# EAGLE design axxl_v0.1 (EAGLE 6.6.0)
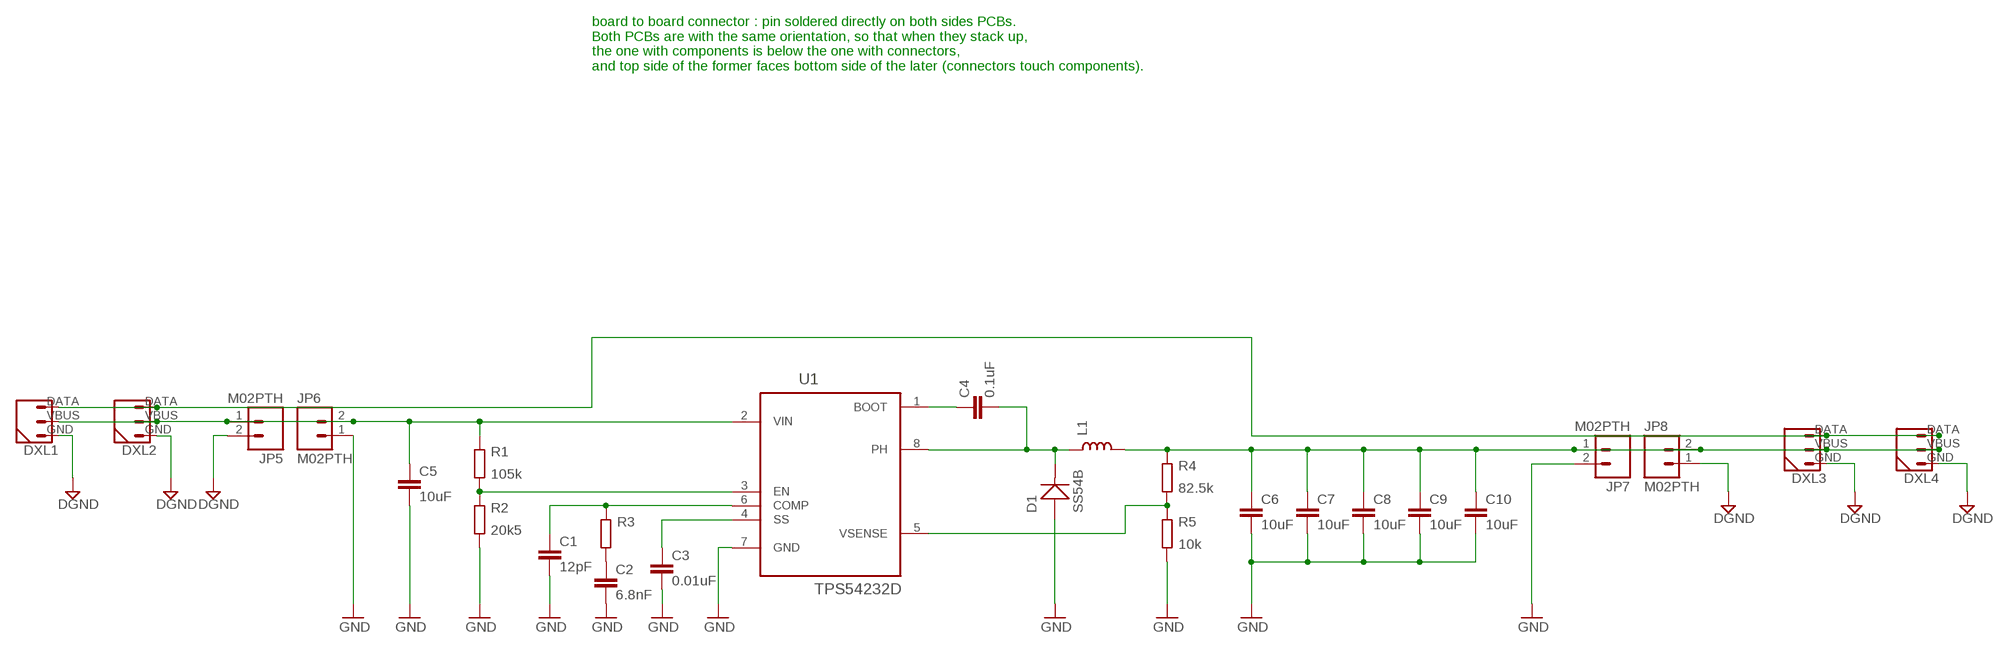
[diagram p0: schematic, sheet 1]

## Parts
C1  12pF  C0402  [0402_N]
C2  6.8nF  C0402  [0402_N]
C3  0.01uF  C0402  [0402_N]
C4  0.1uF  C0402  [0402_N]
C5  10uF  C0805  [0805_N]
C6  10uF  C0805  [0805_N]
C7  10uF  C0805  [0805_N]
C8  10uF  C0805  [0805_N]
C9  10uF  C0805  [0805_N]
C10  10uF  C0805  [0805_N]
D1  SS54B  D-SMB  [SMB]
DXL1  DYNAMIXEL_3POS-R  [DYNAMIXEL_3POS_RIGHT]
DXL2  DYNAMIXEL_3POS-R  [DYNAMIXEL_3POS_RIGHT]
DXL3  DYNAMIXEL_3POS-XL-R  [DYNAMIXEL_XL_RIGHT]
DXL4  DYNAMIXEL_3POS-XL-R  [DYNAMIXEL_XL_RIGHT]
JP5  M02PTH  [1X02]
JP6  M02PTH  [1X02]
JP7  M02PTH  [1X02]
JP8  M02PTH  [1X02]
L1  L-SMD_8X8  [L_SRU8043]
R1  105k  R0402  [0402_N]
R2  20k5  R0402  [0402_N]
R3  R0402  [0402_N]
R4  82.5k  R0402  [0402_N]
R5  10k  R0402  [0402_N]
U1  TPS54232D  [SOIC127P600X175-8N]

## Nets
DGND: DXL1.GND DXL2.GND DXL3.GND DXL4.GND JP5.2 JP8.1
GND: C1.2 C2.2 C3.2 C5.2 C6.2 C7.2 C8.2 C9.2 C10.2 D1.+ JP6.1 JP7.2 R2.1 R5.1 U1.7(GND)
N$2: C1.1 R3.2 U1.6(COMP)
N$3: C6.1 C7.1 C8.1 C9.1 C10.1 DXL3.VBUS DXL4.VBUS JP7.1 JP8.2 L1.P$2 R4.2
N$4: R1.1 R2.2 U1.3(EN)
N$5: C2.1 R3.1
N$6: C3.1 U1.4(SS)
N$7: C4.1 U1.1(BOOT)
N$8: C4.2 D1.- L1.P$1 U1.8(PH)
N$9: DXL1.DATA DXL2.DATA DXL3.DATA DXL4.DATA
N$11: R4.1 R5.2 U1.5(VSENSE)
N$12: C5.1 DXL1.VBUS DXL2.VBUS JP5.1 JP6.2 R1.2 U1.2(VIN)

## Notes on the sheet
- board to board connector : pin soldered directly on both sides PCBs.
  Both PCBs are with the same orientation, so that when they stack up,
  the one with components is below the one with connectors,
  and top side of the former faces bottom side of the later (connectors touch components).

## Library data of the parts
C1-C10 = Xevelabs:C: Non-polarized Capacitor
D1 = OPL:D*: DIODE
DXL1-DXL4 = Xevelabs:DYNAMIXEL_3POS
JP5-JP8 = SparkFun-Connectors:M02: Standard 2-pin 0.1" header. Use with - straight break away headers ( PRT-00116) - right angle break away headers (PRT-00553) - swiss pins (PRT-00743) - machine pins (PRT-00117) - female headers (PRT-00115) Molex polarized connector foot print use with: PRT-08233 with associated crimp pins and housings. 2.54_SCREWTERM for use with PRT-10571. 3.5mm Screw Terminal footprints for PRT-08084 5mm Screw Terminal footprints for use with PRT-08433
L1 = AirQuality-sensors:L
R1-R5 = Xevelabs:R: Resistor
U1 = Xevelabs:TPS54232D: DC/DC CONVERTER; MPN: TPS54232D; OC_FARNELL: 1694430; OC_NEWARK: 45P2940; PACKAGE: SOIC-8; SUPPLIER: TEXAS INSTRUMENTS

## Board
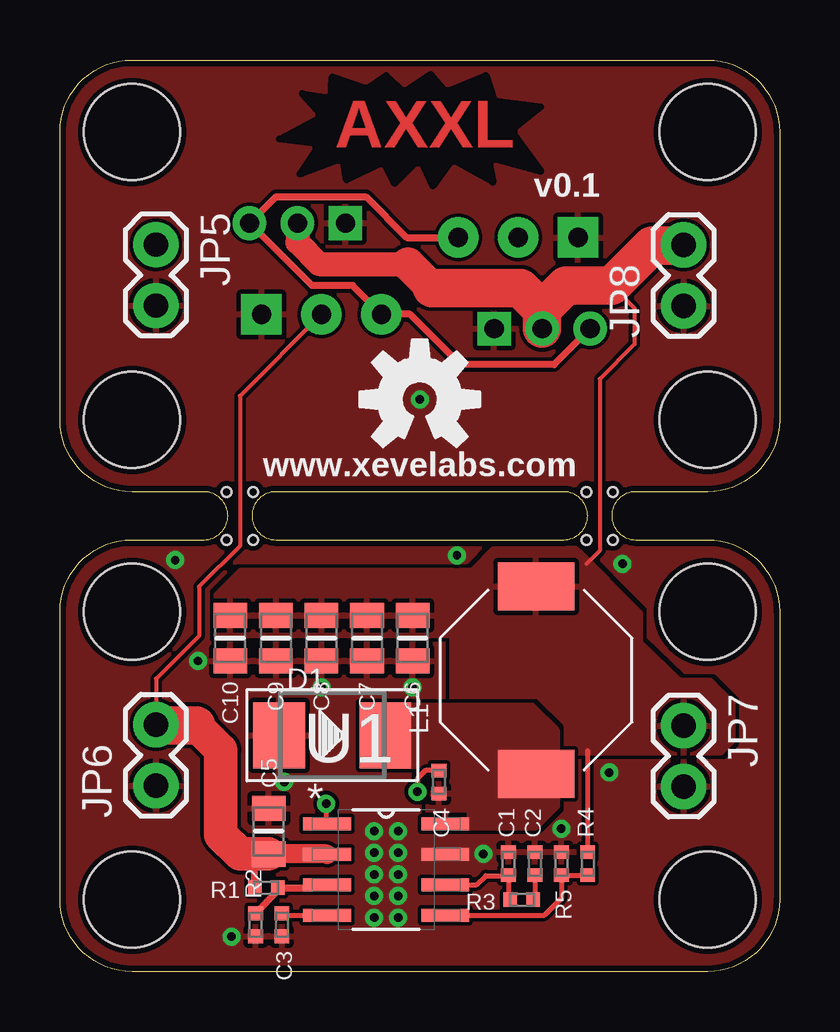
[diagram p1: board, top side]
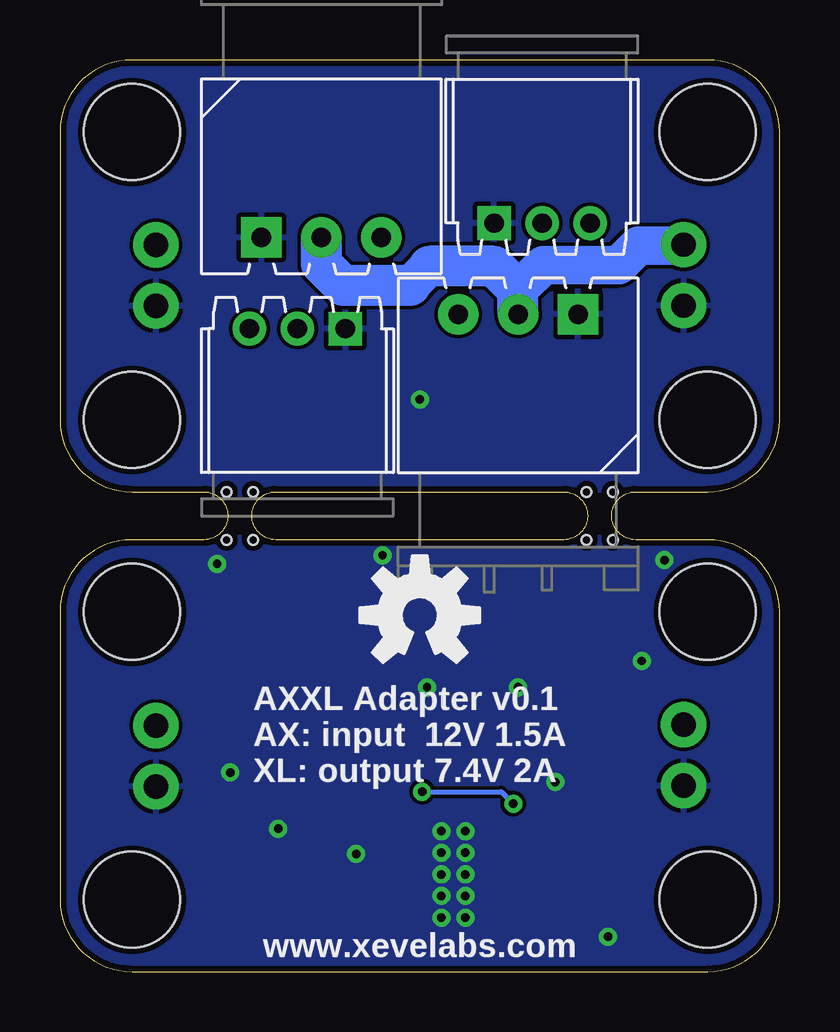
[diagram p2: board, bottom side, seen from below]

Size 30 x 38 mm. Coordinates in mm from the lower left corner, seen from the top.
Outline: 30,15 30,3 arc-90 27,0 3,0 arc-90 0,3 0,15 arc-90 3,18 6,18 arc180 6,20 3,20 arc-90 0,23 0,35 arc-90 3,38 27,38 arc-90 30,35 30,23 arc-90 27,20 24,20 arc180 24,18 27,18 arc-90 30,15
Outline: 9,20 arc180 9,18 21,18 arc180 21,20 9,20
Copper layers (1*16): Top 0.035mm / dielectric 1.55mm / Bottom 0.035mm
Design rules "Xevelabs_6mil_eurocircuits": minimum track width 0.15mm, minimum drill 0.25mm, track to track 0.155mm, track to pad 0.155mm, pad to pad 0.155mm, via to via 0.155mm, smd to smd 0mil, copper to edge 0.25mm, drill to drill 0.25mm, minimum pad ring 0mil, minimum via ring 0.2mm, stop-mask expansion 0mil, vias tented up to drill 100mil, thermal gap 0.2mm
Holes 4 mm at 3,3 3,15 27,3 27,15 3,23 3,35 27,23 27,35
Holes 0.4 mm at 21.95,20 23.05,20 21.95,18 23.05,18 6.95,20 8.05,20 6.95,18 8.05,18
tKeepout: area 0.5,0.5 to 5.5,5.5; area 0.5,12.5 to 5.5,17.5; area 24.5,12.5 to 29.5,17.5; area 24.5,0.5 to 29.5,5.5; area 0.5,20.5 to 5.5,25.5; area 0.5,32.5 to 5.5,37.5; area 24.5,32.5 to 29.5,37.5; area 24.5,20.5 to 29.5,25.5
tRestrict: area 9.2,32.8 to 20.1,37.4

### Footprints (pad centres in the part's own frame; a part is rotated, then mirrored left to right if it is on the bottom)
0402_N = smd 0.57 x 0.62: 1 -0.48,0; 2 0.48,0
0805_N = smd 1.05 x 1.4: 1 -0.95,0; 2 0.95,0
SMB = smd 2.159 x 2.743: + -2.21,0; - 2.21,0
DYNAMIXEL_3POS_RIGHT = drill 0.8 pad 1.676: DATA 0,-5; VBUS 0,-2.5 | drill 0.8 pad 1.676 square: GND 0,0
DYNAMIXEL_XL_RIGHT = drill 0.8 pad 1.4: DATA 0,-2; VBUS 0,0 | drill 0.8 pad 1.4 square: GND 0,2
1X02 = drill 1.016 pad 1.88: 1 0,0; 2 2.54,0
L_SRU8043 = smd 2 x 3.2: P$1 -3.9,0; P$2 3.9,0
SOIC127P600X175-8N = smd 1.981 x 0.559: 1 -2.464,1.905; 2 -2.464,0.635; 3 -2.464,-0.635; 4 -2.464,-1.905; 5 2.464,-1.905; 6 2.464,-0.635; 7 2.464,0.635; 8 2.464,1.905

### Placement (x,y rotation side)
C1  18.7,4.5 90 top
C2  19.8,4.5 90 top
C3  9.25,1.95 270 top
C4  15.8,7.9 270 top
C5  8.7,5.85 90 top
C6  14.7,13.9 270 top
C7  12.8,13.9 270 top
C8  10.9,13.9 270 top
C9  9,13.9 270 top
C10  7.1,13.9 270 top
D1  11.35,9.85 0 top
DXL1  8.4,27.4 270 bottom
DXL2  21.6,30.6 90 bottom
DXL3  20.1,26.8 270 bottom
DXL4  9.9,31.2 90 bottom
JP5  4,30.3 270 top
JP6  4,7.75 90 top
JP7  26,10.25 270 top
JP8  26,27.75 90 top
L1  19.85,12.15 90 top
R1  8.6,3.5 180 top
R2  8.15,1.95 90 top
R3  19.25,3 180 top
R4  22,4.5 90 top
R5  20.9,4.5 270 top
U1  13.6,4.25 0 top
U$1  [OSHW-LOGO-M]  15,23.85 0 top
U$2  [OSHW-LOGO-M]  15,14.85 0 bottom

### Tracks (layer width: path | path; a pad name or v marks a point on that pad's centre or on a via)
DGND  (via drill 0.35)
  other vias: 15,23.85
  pour Top: -1,39.5 30.9,39.3 31.3,19.7 -1.3,19.6
  pour Bottom: -0.5,39.8 31.4,39.6 31.9,19.7 -0.8,20.2
GND  (via drill 0.35)
  other vias: 14.1,4.95 17.65,4.9 13.1,5.85 14.1,5.85 13.1,4.95 14.1,4.05 13.1,4.05 14.1,3.15 13.1,3.15 13.1,2.25 14.1,2.25 7.15,1.45 9.35,7.9 20.9,5.95 5.75,12.95 10.9,11.85 14.7,11.85 22.9,8.3 16.55,17.35 23.45,17 4.8,17.15
  pour Top (rank 6): -1.1,18.3 31.2,18.7 31.5,-1.2 -1.2,-0.7
  pour Bottom: -1.2,18.1 30.95,18.1 31.3,-1.2 -1.4,-0.7
  pour Top (no thermals): 14.55,5.55 17.45,5.55 17.45,4.2 14.55,4.2
N$2
  Top 0.2: C1.1 18.7,3.07 R3.2 | C1.1 18.59,3.92 | U1.6 17.36,3.62 17.75,4 18.68,4 C1.1
N$3
  Top 0.16: 23,28.6 23.95,27.65 23.95,26.15 22.5,24.7 22.5,17.55 21.95,17
  Top 0.2: R4.2 22,9.2
  Top 1: DXL4.VBUS 9.9,30.4 10.8,29.5 14.5,29.5
  Top 1.4: 15.5,28.5 14.5,29.5
  Top 1.6: DXL3.VBUS 20.1,27.6 | 20.1,27.6 19.2,28.5 15.5,28.5 | 20.1,27.6 21.1,28.6 23,28.6 24.67,30.27 25.98,30.27 JP8.2
  pour Top (rank 3): 18.1,17.65 21.5,17.65 24.2,14.95 24.2,13.75 25.85,12.15 27.1,12.15 28.05,11.2 28.05,9.61 27.54,9.1 18.35,9.1 16.35,11 16.35,14 6.5,14 6.5,15.7 7.55,16.75 17.2,16.75
N$4
  Top 0.3: U1.3 11.02,3.5 R1.1 9.08,3.46 9.08,3.36 R2.2
N$5
  Top 0.2: C2.1 19.8,3.07 R3.1
N$6
  Top 0.2: C3.1 9.34,2.35 U1.4
N$7  (via drill 0.35)
  Top 0.2: C4.1 15.23,8.38 14.9,8.05 v14.9,7.5 | v11.1,7 11.1,6.15 U1.1
  Bottom 0.2: v14.9,7.5 11.6,7.5 v11.1,7
N$8
  pour Top (rank 2, no thermals): 13.6,8.55 17.05,8.55 17.05,6 19.85,6 20.75,6.9 20.75,10.05 19.7,11.1 13.6,11.1
  pour Top (rank 5): 15.35,8.95 17.35,8.9 17.4,6 15.35,6
N$9
  Top 0.3: DXL2.DATA 14.45,30.6 12.75,32.3 9,32.3 DXL4.DATA 10.5,28.6 12.2,28.6 DXL1.DATA 14.6,27.4 16.7,25.3 20.6,25.3 DXL3.DATA
N$11
  Top 0.2: R4.1 R5.2 20.9,3.05 20.2,2.35 U1.5
N$12
  Top 0.16: DXL1.VBUS 7.5,24 7.5,17.75 5.8,16.05 5.8,14 4,12.2 JP6.2
  Top 0.3: R1.2 8.12,4.32 C5.1
  Top 0.8: U1.2 11.12,4.9 C5.1
  Top 1.4: C5.1 7.5,4.9 6.7,5.7 6.7,9.25 5.68,10.27
  Top 1.6: 5.68,10.27 4.02,10.27 JP6.2
  Bottom 1.6: 14.6,29.4 15.4,28.6 | 10.9,28.4 9.85,29.45 6.7,29.45 5.88,30.27 4.03,30.27 JP5.1
  Bottom 1.7: DXL1.VBUS 10.9,28.4 11.9,29.4 14.6,29.4 | 15.4,28.6 18.2,28.6 19.1,29.5 DXL2.VBUS

### Text on the board
Top: AXXL
tPlace: v0.1 | www.xevelabs.com
bPlace: AXXL Adapter v0.1 / AX: input 12V 1.5A / XL: output 7.4V 2A | www.xevelabs.com